# EAGLE design lcamp (EAGLE 9.6.2)
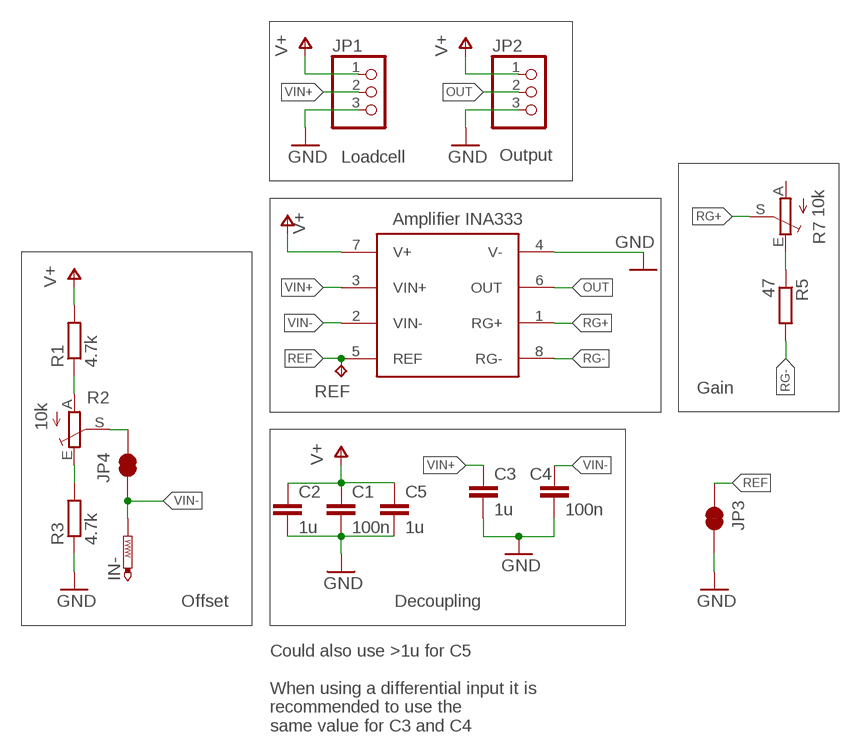
[diagram p0: schematic, sheet 1]

## Parts
C1  100n  C-EUC0603  [C0603]
C2  1u  C-EUC0603  [C0603]
C3  1u  C-EUC0603  [C0603]
C4  100n  C-EUC0603  [C0603]
C5  1u  C-EUC0603  [C0603]
IN-  PTR1PAD1-13  [P1-13]
JP1  PINHD-1X3  [1X03]
JP2  PINHD-1X3  [1X03]
JP3  JUMPER-SMT_2_NC_TRACE_SILK  [SMT-JUMPER_2_NC_TRACE_SILK]
JP4  JUMPER-SMT_2_NC_TRACE_SILK  [SMT-JUMPER_2_NC_TRACE_SILK]
R1  4.7k  R-EU_R0603  [R0603]
R2  10k  TRIM_EU-RJ9W  [RJ9W]
R3  4.7k  R-EU_R0603  [R0603]
R5  47  R-EU_R0603  [R0603]
R7  10k  TRIM_EU-RJ9W  [RJ9W]
REF  TPB1,27  [B1,27]
U1  INA333MSOP8  [MSOP8]

## Nets
GND: C1.2 C2.2 C3.2 C4.2 C5.2 JP1.3 JP2.3 JP3.2 R3.1 U1.4(V-)
N$1: R5.1 R7.E
N$2: R1.1 R2.A
N$3: R2.E R3.2
N$4: JP4.2 R2.S
OUT: JP2.2 U1.6(OUT)
REF: JP3.1 REF.TP U1.5(REF)
RG+: R7.S U1.1(RG+)
RG-: R5.2 U1.8(RG-)
V+: C1.1 C2.1 C5.1 JP1.1 JP2.1 R1.2 U1.7(V+)
VIN+: C3.1 JP1.2 U1.3(VIN+)
VIN-: C4.1 IN-.TP JP4.1 U1.2(VIN-)
Unconnected: R7.A

## Notes on the sheet
- Loadcell | Output
- Amplifier INA333
- Gain
- Offset | Decoupling
- Could also use >1u for C5
  
  When using a differential input it is
  recommended to use the 
  same value for C3 and C4

## Library data of the parts
C1-C5 = resistor:C-EU: CAPACITOR, European symbol
IN- = testpad:PTR1: TEST PIN
JP1 JP2 = pinhead:PINHD-1X3: PIN HEADER
JP3 JP4 = SparkFun-Jumpers:JUMPER-SMT_2_NC_TRACE: Normally closed trace jumper This jumper has a trace between two pads so it's normally closed (NC). Use a razor knife to open the connection. For best results follow the IPC guidelines for cutting traces: Cutout at least 0.063 mm (0.005 in). Remove all loose material to clean up the cut area. Seal the cut with an approved epoxy. Reapply solder to reclose the connection.
R1 R3 R5 = resistor:R-EU_: RESISTOR, European symbol
R2 R7 = pot:TRIM_EU-: POTENTIOMETER
REF = testpad:TP: Test pad
U1 = lcamp:INA333

## Board
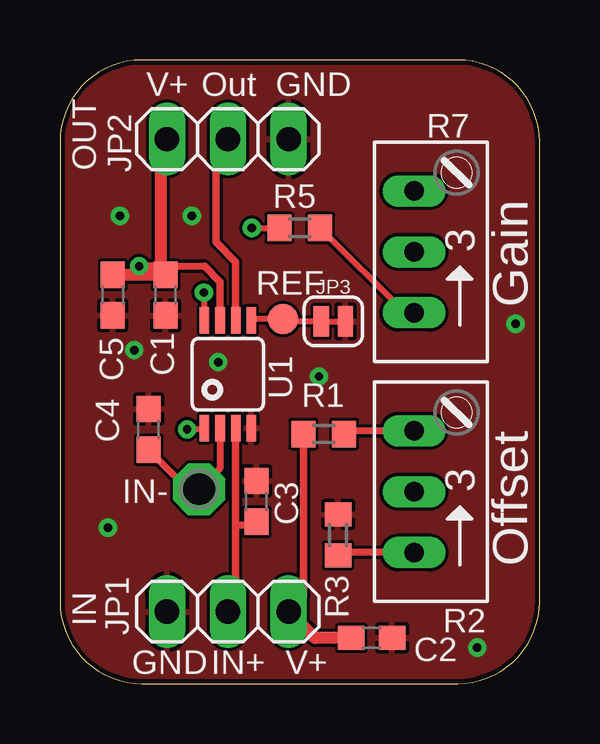
[diagram p1: board, top side]
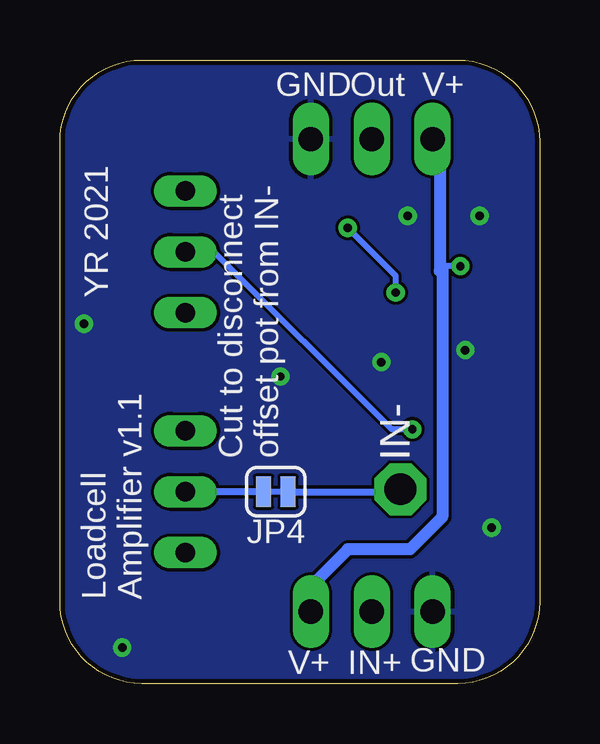
[diagram p2: board, bottom side, seen from below]

Size 20 x 26 mm. Coordinates in mm from the lower left corner, seen from the top.
Outline: 0,22.59 0,3.41 arc90 3.41,0 16.59,0 arc90 20,3.41 20,22.59 arc90 16.59,26 3.41,26 arc90 0,22.59
Copper layers (1*16): Top 0.035mm / dielectric 1.5mm / Bottom 0.035mm
Design rules "jlcpcb": minimum track width 5mil, minimum drill 0.3mm, track to track 5mil, track to pad 5mil, pad to pad 5mil, via to via 5mil, smd to smd 5mil, copper to edge 0.2mm, drill to drill 8mil, minimum pad ring 10mil, minimum via ring 8mil, stop-mask expansion 4mil, vias tented up to drill 0mil, thermal gap 6mil

### Footprints (pad centres in the part's own frame; a part is rotated, then mirrored left to right if it is on the bottom)
C0603 = smd 1.1 x 1: 1 -0.85,0; 2 0.85,0
P1-13 = drill 1.321 pad 2.159 octagon: TP 0,0
1X03 = drill 1.016 long: 1 -2.54,0; 2 0,0; 3 2.54,0
SMT-JUMPER_2_NC_TRACE_SILK = smd 0.635 x 1.27: 1 -0.508,0; 2 0.508,0
R0603 = smd 1 x 1.1: 1 -0.85,0; 2 0.85,0
RJ9W = drill 0.813 long: A 2.54,0.635; E -2.54,0.635; S 0,0.635
B1,27 = smd 1.27 x 1.27: TP 0,0
MSOP8 = smd 0.4 x 1.1: 1 -0.975,-2.25; 2 -0.325,-2.25; 3 0.325,-2.25; 4 0.975,-2.25; 5 0.975,2.25; 6 0.325,2.25; 7 -0.325,2.25; 8 -0.975,2.25

### Placement (x,y rotation side)
C1  4.4,16.2 270 top
C2  13,1.9 0 top
C3  8.2,7.6 90 top
C4  3.7,10.6 90 top
C5  2.2,16.2 270 top
IN-  5.8,8.1 0 top
JP1  7,3 180 top
JP2  7,22.7 0 top
JP3  11.4,15.1 0 top
JP4  11,8 180 bottom
R1  11,10.4 180 top
R2  15.4,8 90 top
R3  11.6,6.2 270 top
R5  10,19 180 top
R7  15.4,18 90 top
REF  9.3,15.2 0 top
U1  7,12.9 0 top

### Tracks (layer width: path | path; a pad name or v marks a point on that pad's centre or on a via)
GND  (via drill 0.35)
  other vias: 10.8,12.8 2,6.5 2.5,19.5 5.5,19.5 3.1,13.9 17.4,1.5 19,15 6.6,13.4
  pour Top: 0,27 0,-1 20,-1 20,27
  pour Bottom: 20,27 -1,27 -1,-1 20,-1
N$1
  Top 0.254: R5.1 14.39,15.46 R7.E
N$2
  Top 0.3: R2.A 11.99,10.54 R1.1
N$3
  Top 0.3: R2.E 11.71,5.46 R3.2
N$4
  Bottom 0.3: JP4.2 R2.S
OUT
  Top 0.305: U1.6 7.33,17.57 6.5,18.4 6.5,22.2 JP2.2
REF
  Top 0.254: REF.TP 8.03,15.2 U1.5 | REF.TP 9.73,15.2 | JP3.1 9.4,15.1 REF.TP
RG+  (via drill 0.35)
  Top 0.254: U1.1 6.03,10.6 v5.3,10.6
  Bottom 0.254: R7.S 13.56,18 6.17,10.6 v5.3,10.6
RG-  (via drill 0.35)
  Top 0.254: U1.8 6.03,16.27 v6,16.3 | v8,19 R5.2
  Bottom 0.254: v6,16.3 6,17 v8,19
V+  (via drill 0.35)
  Top 0.254: C1.1 4.4,17.4 | v3.3,17.4 3.4,17.3
  Top 0.3: 6.03,17.4 4.75,17.4 C1.1 4.2,17.25 4.2,17.45
  Top 0.305: R1.2 10.15,3.61 JP1.1 | U1.7 6.67,16.75 6.03,17.4 | 4.2,17.45 4.2,18.95
  Top 0.508: JP2.1 4.2,22.44 4.2,18.95 4.2,17.3 3.4,17.3 | C2.1 10.64,1.9 JP1.1 | C5.1 C1.1
  Bottom 0.254: 4.06,17.3 3.96,17.4 v3.3,17.4
  Bottom 0.508: JP2.1 4.16,22.4 4.16,17.2 4.06,17.3 4.06,6.94 5.4,5.6 8,5.6 9.54,4.06 JP1.1
VIN+
  Top 0.254: 7.33,3.33 JP1.2
  Top 0.3: C3.1 8.05,6.6 7.33,6.6
  Top 0.305: U1.3 7.33,6.6 7.33,3.33
VIN-
  Top 0.3: U1.2 6.67,8.97 IN-.TP 5.35,8.1 C4.1
  Bottom 0.3: IN-.TP 5.9,8 JP4.1

### Text on the board
tPlace: V+ | Out | GND | OUT | Gain | Offset | IN | GND | IN+ | V+
bPlace: V+ | Out | GND | YR 2021 | IN- | Cut to disconnect / offset pot from IN- | Loadcell / Amplifier v1.1 | GND | IN+ | V+